# EAGLE design FSShield (EAGLE 9.5.2)
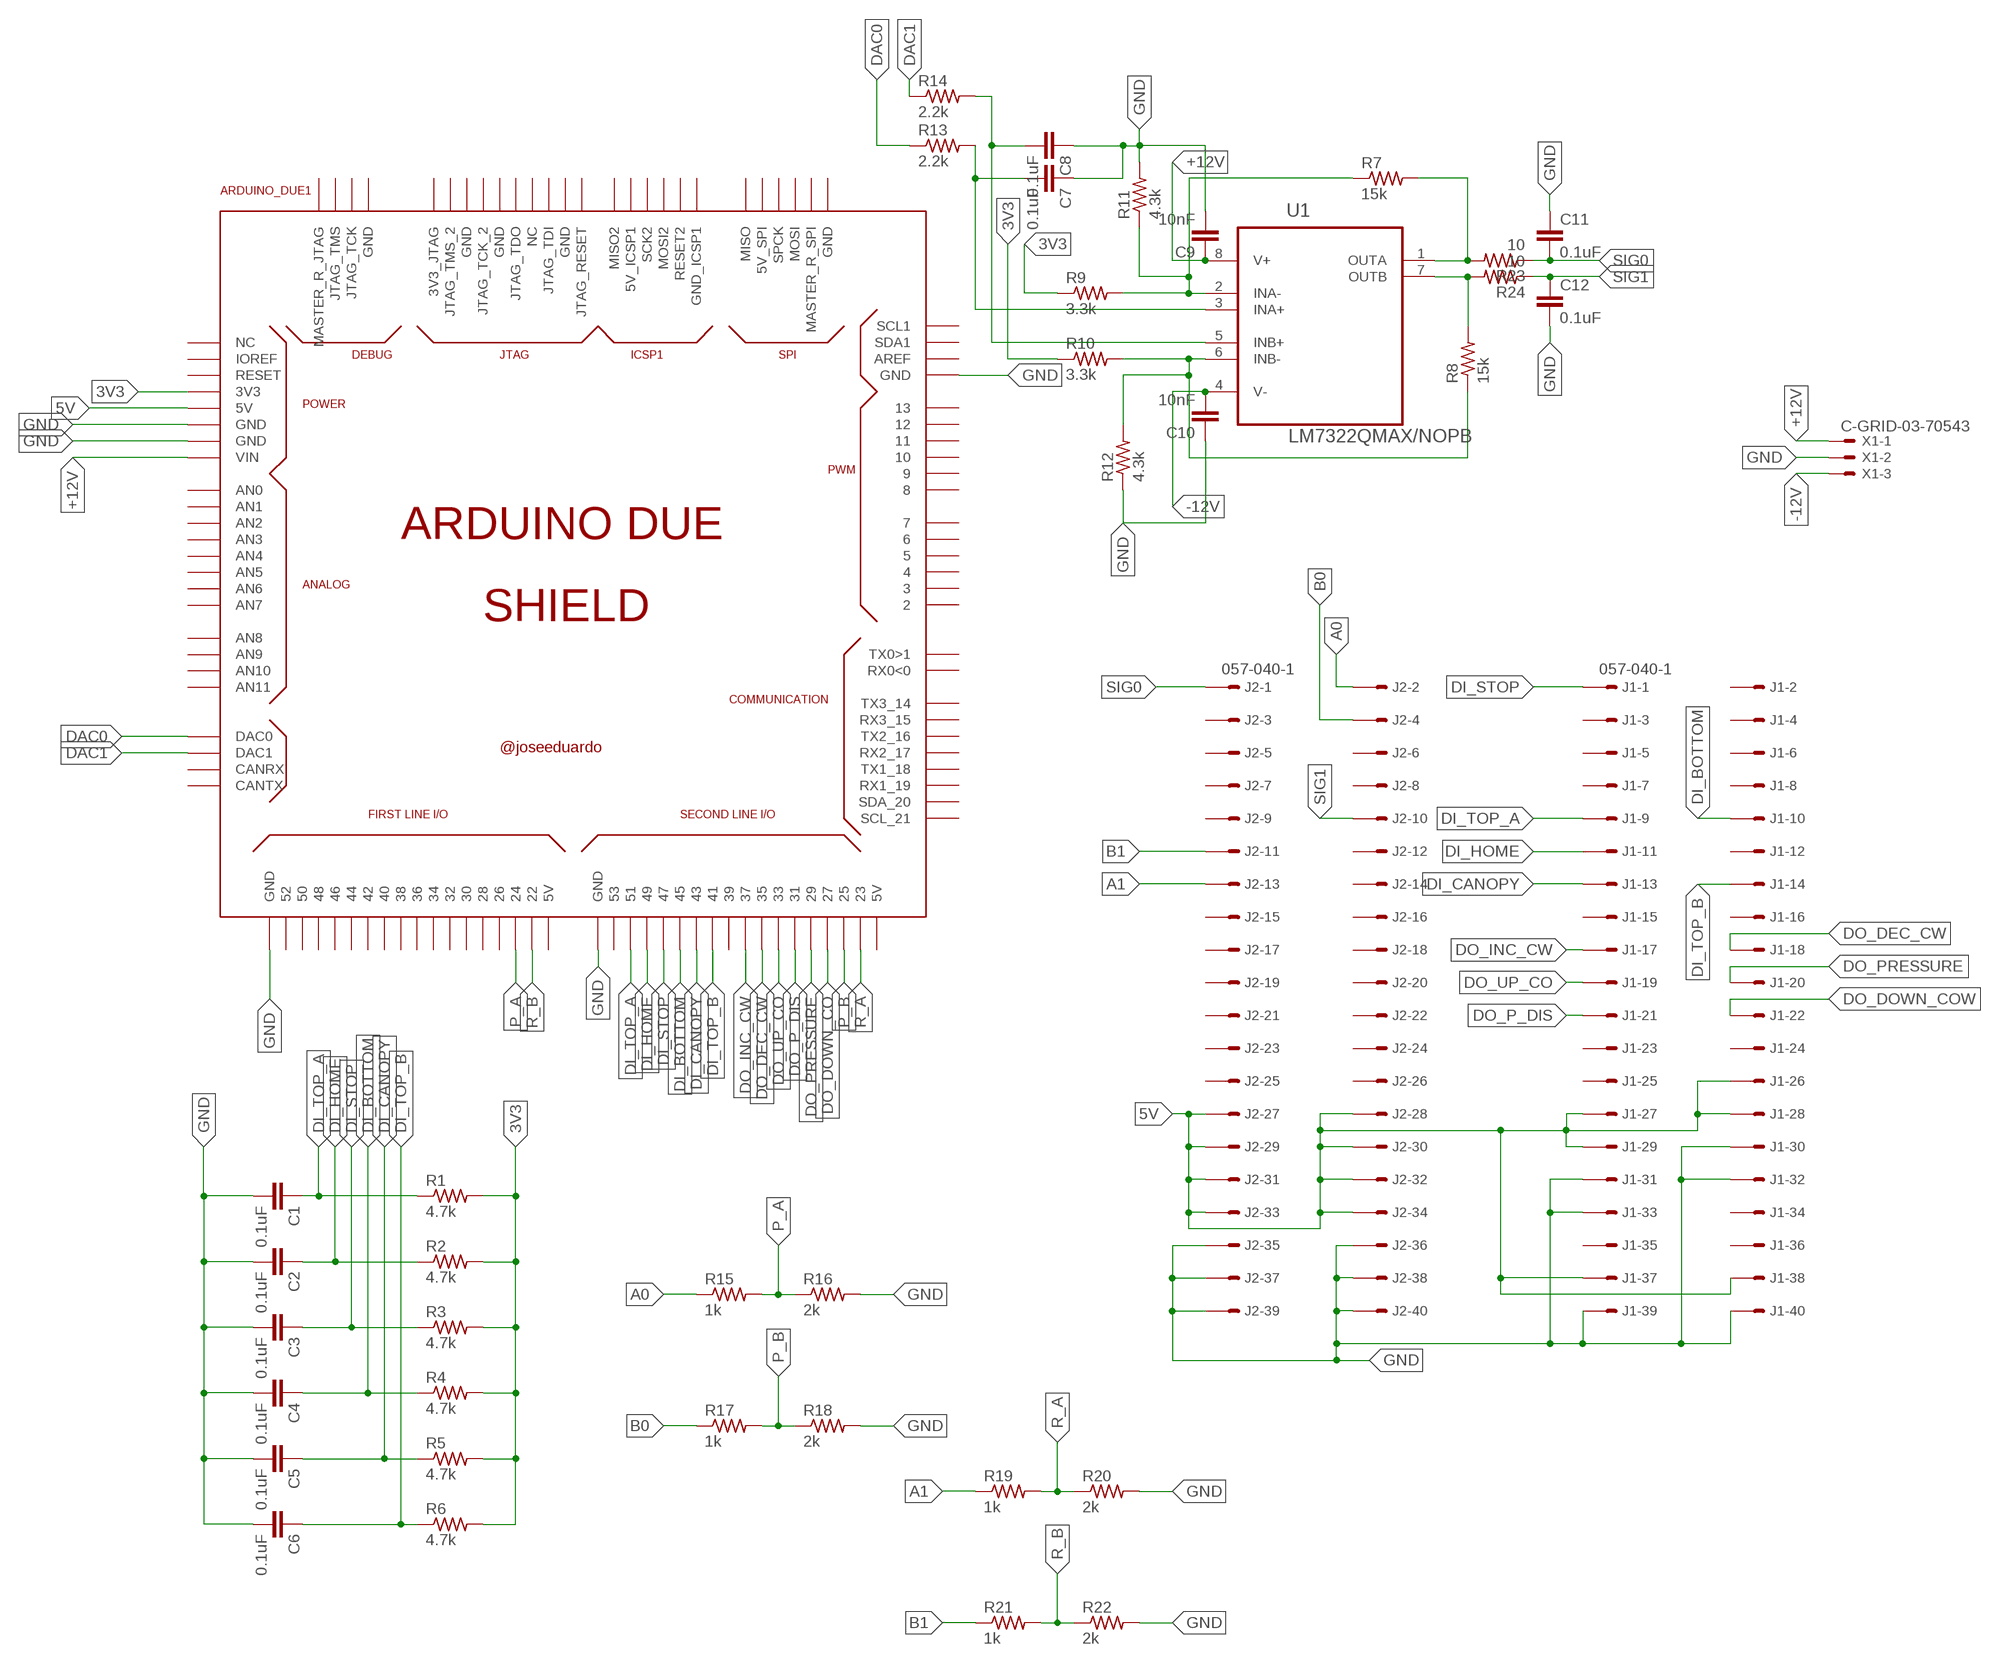
[diagram p0: schematic, sheet 1]

## Parts
ARDUINO_DUE1  ARDUINO_DUE_SHIELD  [ARDUINO_DUE_SHIELD]
C1  0.1uF  0.1UF-0603-25V-(+80/-20%)  [0603]
C2  0.1uF  0.1UF-0603-25V-(+80/-20%)  [0603]
C3  0.1uF  0.1UF-0603-25V-(+80/-20%)  [0603]
C4  0.1uF  0.1UF-0603-25V-(+80/-20%)  [0603]
C5  0.1uF  0.1UF-0603-25V-(+80/-20%)  [0603]
C6  0.1uF  0.1UF-0603-25V-(+80/-20%)  [0603]
C7  0.1uF  0.1UF-0603-25V-(+80/-20%)  [0603]
C8  0.1uF  0.1UF-0603-25V-(+80/-20%)  [0603]
C9  10nF  10NF-0603-50V-10%  [0603]
C10  10nF  10NF-0603-50V-10%  [0603]
C11  0.1uF  0.1UF-0603-25V-(+80/-20%)  [0603]
C12  0.1uF  0.1UF-0603-25V-(+80/-20%)  [0603]
J1  057-040-1  [057-040-1]
J2  057-040-1  [057-040-1]
R1  4.7k  R-US_M0805  [M0805]
R2  4.7k  R-US_M0805  [M0805]
R3  4.7k  R-US_M0805  [M0805]
R4  4.7k  R-US_M0805  [M0805]
R5  4.7k  R-US_M0805  [M0805]
R6  4.7k  R-US_M0805  [M0805]
R7  15k  R-US_M0805  [M0805]
R8  15k  R-US_M0805  [M0805]
R9  3.3k  R-US_M0805  [M0805]
R10  3.3k  R-US_M0805  [M0805]
R11  4.3k  R-US_M0805  [M0805]
R12  4.3k  R-US_M0805  [M0805]
R13  2.2k  R-US_M0805  [M0805]
R14  2.2k  R-US_M0805  [M0805]
R15  1k  R-US_M0805  [M0805]
R16  2k  R-US_M0805  [M0805]
R17  1k  R-US_M0805  [M0805]
R18  2k  R-US_M0805  [M0805]
R19  1k  R-US_M0805  [M0805]
R20  2k  R-US_M0805  [M0805]
R21  1k  R-US_M0805  [M0805]
R22  2k  R-US_M0805  [M0805]
R23  10  R-US_M0805  [M0805]
R24  10  R-US_M0805  [M0805]
U1  LM7322QMAX/NOPB  [SOIC127P600X175-8N]
X1  C-GRID-03-70543  [70543-03]

## Nets
3V3 [PWR]: ARDUINO_DUE1.3V3 R1.2 R2.2 R3.2 R4.2 R5.2 R6.2 R9.1 R10.1
5V [PWR]: ARDUINO_DUE1.5V0(5V) J1.26 J1.27 J1.28 J1.29 J1.37 J1.38 J2.27 J2.28 J2.29 J2.30 J2.31 J2.32 J2.33 J2.34
+12V [PWR]: ARDUINO_DUE1.VIN C9.1 U1.8(V+) X1.1
-12V [PWR]: C10.2 U1.4(V-) X1.3
A0: J2.2 R15.1
A1: J2.13 R19.1
B0: J2.4 R17.1
B1: J2.11 R21.1
DAC0: ARDUINO_DUE1.DAC0 R13.1
DAC1: ARDUINO_DUE1.DAC1 R14.1
DI_BOTTOM: ARDUINO_DUE1.45 C4.1 J1.10 R4.1
DI_CANOPY: ARDUINO_DUE1.43 C5.1 J1.13 R5.1
DI_HOME: ARDUINO_DUE1.49 C2.1 J1.11 R2.1
DI_STOP: ARDUINO_DUE1.47 C3.1 J1.1 R3.1
DI_TOP_A: ARDUINO_DUE1.51 C1.1 J1.9 R1.1
DI_TOP_B: ARDUINO_DUE1.41 C6.1 J1.14 R6.1
DO_DEC_CW: ARDUINO_DUE1.35 J1.18
DO_DOWN_CO: ARDUINO_DUE1.27
DO_DOWN_COW: J1.22
DO_INC_CW: ARDUINO_DUE1.37 J1.17
DO_P_DIS: ARDUINO_DUE1.31 J1.21
DO_PRESSURE: ARDUINO_DUE1.29 J1.20
DO_UP_CO: ARDUINO_DUE1.33 J1.19
GND [GND]: ARDUINO_DUE1.GND ARDUINO_DUE1.GND_1(GND) ARDUINO_DUE1.GND_2(GND) ARDUINO_DUE1.GND_3(GND) ARDUINO_DUE1.GND_4(GND) C1.2 C2.2 C3.2 C4.2 C5.2 C6.2 C7.1 C8.1 C9.2 C10.1 C11.1 C12.2 J1.30 J1.31 J1.32 J1.33 J1.39 J1.40 J2.35 J2.36 J2.37 J2.38 J2.39 J2.40 R11.2 R12.1 R16.2 R18.2 R20.2 R22.2 X1.2
N$1: R7.1 R9.2 R11.1 U1.2(INA-)
N$2: R8.1 R10.2 R12.2 U1.6(INB-)
N$3: C7.2 R13.2 U1.3(INA+)
N$4: C8.2 R14.2 U1.5(INB+)
N$5: C12.1 R24.1
N$6: C11.2 R23.1
P_A: ARDUINO_DUE1.24 R15.2 R16.1
P_B: ARDUINO_DUE1.25 R17.2 R18.1
R_A: ARDUINO_DUE1.23 R19.2 R20.1
R_B: ARDUINO_DUE1.22 R21.2 R22.1
SIG0: J2.1 R7.2 R23.2 U1.1(OUTA)
SIG1: J2.10 R8.2 R24.2 U1.7(OUTB)
Unconnected: ARDUINO_DUE1.0(RX0<0) ARDUINO_DUE1.1(TX0>1) ARDUINO_DUE1.2 ARDUINO_DUE1.3 ARDUINO_DUE1.3V3_JTAG ARDUINO_DUE1.4 ARDUINO_DUE1.5 ARDUINO_DUE1.5V0_1(5V) ARDUINO_DUE1.5V0_2(5V) ARDUINO_DUE1.5V_2(5V_SPI) ARDUINO_DUE1.5V_ICSP1 ARDUINO_DUE1.6 ARDUINO_DUE1.7 ARDUINO_DUE1.8 ARDUINO_DUE1.9 ARDUINO_DUE1.10 ARDUINO_DUE1.11 ARDUINO_DUE1.12 ARDUINO_DUE1.13 ARDUINO_DUE1.14(TX3_14) ARDUINO_DUE1.15(RX3_15) ARDUINO_DUE1.16(TX2_16) ARDUINO_DUE1.17(RX2_17) ARDUINO_DUE1.18(TX1_18) ARDUINO_DUE1.19(RX1_19) ARDUINO_DUE1.20(SDA_20) ARDUINO_DUE1.21(SCL_21) ARDUINO_DUE1.26 ARDUINO_DUE1.28 ARDUINO_DUE1.30 ARDUINO_DUE1.32 ARDUINO_DUE1.34 ARDUINO_DUE1.36 ARDUINO_DUE1.38 ARDUINO_DUE1.39 ARDUINO_DUE1.40 ARDUINO_DUE1.42 ARDUINO_DUE1.44 ARDUINO_DUE1.46 ARDUINO_DUE1.48 ARDUINO_DUE1.50 ARDUINO_DUE1.52 ARDUINO_DUE1.53 ARDUINO_DUE1.A0(AN0) ARDUINO_DUE1.A1(AN1) ARDUINO_DUE1.A2(AN2) ARDUINO_DUE1.A3(AN3) ARDUINO_DUE1.A4(AN4) ARDUINO_DUE1.A5(AN5) ARDUINO_DUE1.A6(AN6) ARDUINO_DUE1.A7(AN7) ARDUINO_DUE1.A8(AN8) ARDUINO_DUE1.A9(AN9) ARDUINO_DUE1.A10(AN10) ARDUINO_DUE1.A11(AN11) ARDUINO_DUE1.AREF ARDUINO_DUE1.CANRX ARDUINO_DUE1.CANTX ARDUINO_DUE1.GND_5(GND) ARDUINO_DUE1.GND_7(GND) ARDUINO_DUE1.GND_8(GND) ARDUINO_DUE1.GND_9(GND) ARDUINO_DUE1.GND_10(GND) ARDUINO_DUE1.GND_ICSP1 ARDUINO_DUE1.IOREF ARDUINO_DUE1.JTAG_RESET ARDUINO_DUE1.JTAG_TCK ARDUINO_DUE1.JTAG_TCK_2 ARDUINO_DUE1.JTAG_TDI ARDUINO_DUE1.JTAG_TDO ARDUINO_DUE1.JTAG_TMS ARDUINO_DUE1.JTAG_TMS_2 ARDUINO_DUE1.MASTER_RESET_JTAG(MASTER_R_JTAG) ARDUINO_DUE1.MASTER_RESET_SPI(MASTER_R_SPI) ARDUINO_DUE1.MISO ARDUINO_DUE1.MISO2 ARDUINO_DUE1.MOSI ARDUINO_DUE1.MOSI2 ARDUINO_DUE1.NC_2(NC) ARDUINO_DUE1.NC_5(NC) ARDUINO_DUE1.RESET ARDUINO_DUE1.RESET2 ARDUINO_DUE1.SCK2 ARDUINO_DUE1.SCL1 ARDUINO_DUE1.SDA1 ARDUINO_DUE1.SPCK J1.2 J1.3 J1.4 J1.5 J1.6 J1.7 J1.8 J1.12 J1.15 J1.16 J1.23 J1.24 J1.25 J1.34 J1.35 J1.36 J2.3 J2.5 J2.6 J2.7 J2.8 J2.9 J2.12 J2.14 J2.15 J2.16 J2.17 J2.18 J2.19 J2.20 J2.21 J2.22 J2.23 J2.24 J2.25 J2.26

## Library data of the parts
ARDUINO_DUE1 = arduino_due_shield (1):ARDUINO_DUE_SHIELD
C1-C8 C11 C12 = SparkFun-Capacitors:0.1UF: 0.1µF ceramic capacitors A capacitor is a passive two-terminal electrical component used to store electrical energy temporarily in an electric field.; PROD_ID: CAP-00810
C9 C10 = SparkFun-Capacitors:10NF: 0.01uF/10nF/10,000pF ceramic capacitors A capacitor is a passive two-terminal electrical component used to store electrical energy temporarily in an electric field. CAP-09321; PROD_ID: CAP-00867
J1 J2 = con-panduit:057-040-: CONNECTOR 40-pin series 057 contact pc board low profile headers; OC_FARNELL: unknown; OC_NEWARK: unknown
R1-R24 = resistor:R-US_: RESISTOR, American symbol
U1 = LM7322QMAX_NOPB:LM7322QMAX/NOPB: Operational Amplifier; AVAILABILITY: Unavailable; DESCRIPTION: Dual Ch, ail-to- ail I/O, High Output Current & Unlimited Cap Load +/-15V Op Amp 8-SOIC -40 to 125; MF: Texas Instruments; MP: LM7322QMAX/NOPB; PACKAGE: SOIC-8 Texas Instruments; PRICE: None
X1 = con-molex:C-GRID-03: CONNECTOR wire to board 2.54 mm (0.100") pitch header; MF: MOLEX; OC_FARNELL: unknown; OC_NEWARK: unknown

## Net classes
1 GND: width 0.61 mm
2 PWR: width 0.61 mm

## Board
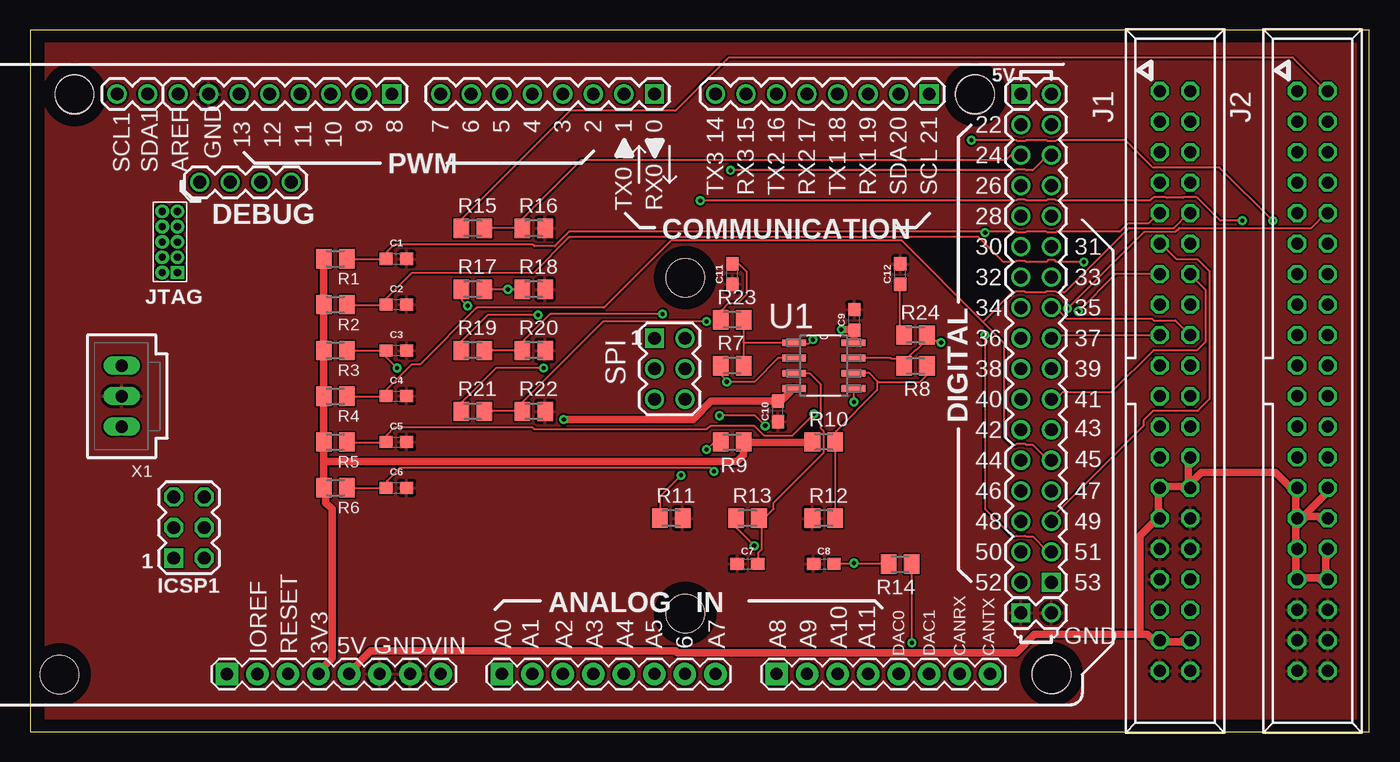
[diagram p1: board, top side]
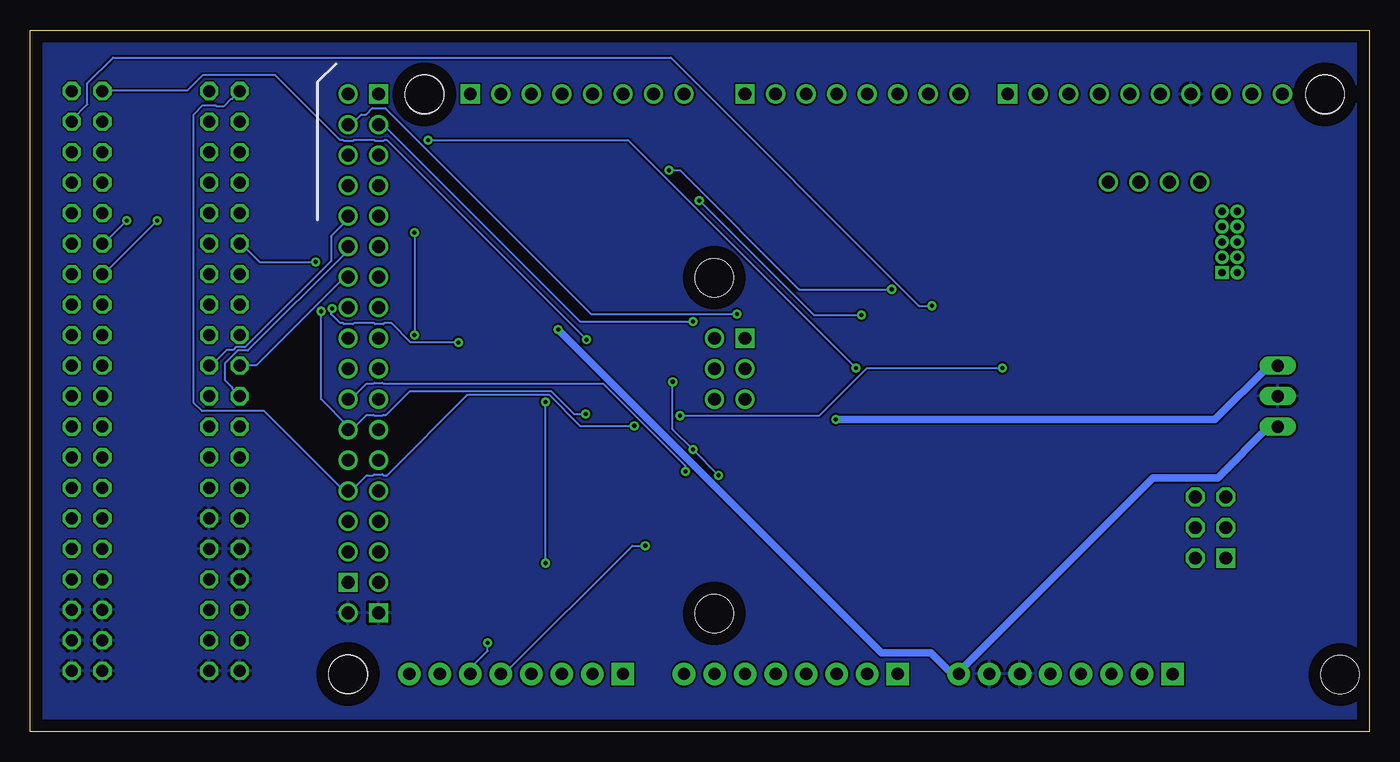
[diagram p2: board, bottom side, seen from below]

Size 111.43 x 58.41 mm. Coordinates in mm from the lower left corner, seen from the top.
Outline: 0,0 111.43,0 111.43,58.41 0,58.41 0,0
Copper layers (1*16): Top 0.035mm / dielectric 1.5mm / Bottom 0.035mm
Design rules "default": minimum track width 6mil, minimum drill 0.35mm, track to track 6mil, track to pad 6mil, pad to pad 6mil, via to via 6mil, smd to smd 6mil, copper to edge 40mil, drill to drill 6mil, minimum pad ring 10mil, minimum via ring 8mil, stop-mask expansion 4mil, vias tented up to drill 0mil, thermal gap 10mil

### Footprints (pad centres in the part's own frame; a part is rotated, then mirrored left to right if it is on the bottom)
ARDUINO_DUE_SHIELD = drill 1.067 square: 0 63.373,51.816; 5V0_1 93.853,51.816; 8 41.529,51.816; 21 86.233,51.816; 53 96.393,11.176; GND_2 93.853,8.636; MISO 63.373,31.496; MISO2 23.384,13.196 | drill 1.067: 1 60.833,51.816; 2 58.293,51.816; 3 55.753,51.816; 4 53.213,51.816; 5 50.673,51.816; 5V0_2 96.393,51.816; 5V_2 65.913,31.496; 6 48.133,51.816; 7 45.593,51.816; 9 38.989,51.816; 10 36.449,51.816; 11 33.909,51.816; 12 31.369,51.816; 13 28.829,51.816; 14 68.453,51.816; 15 70.993,51.816; 16 73.533,51.816; 17 76.073,51.816; 18 78.613,51.816; 19 81.153,51.816; 20 83.693,51.816; 22 93.853,49.276; 23 96.393,49.276; 24 93.853,46.736; 25 96.393,46.736; 26 93.853,44.196; 27 96.393,44.196; 28 93.853,41.656; 29 96.393,41.656; 30 93.853,39.116; 31 96.393,39.116; 32 93.853,36.576; 33 96.393,36.576; 34 93.853,34.036; 35 96.393,34.036; 36 93.853,31.496; 37 96.393,31.496; 38 93.853,28.956; 39 96.393,28.956; 40 93.853,26.416; 41 96.393,26.416; 42 93.853,23.876; 43 96.393,23.876; 44 93.853,21.336; 45 96.393,21.336; 46 93.853,18.796; 47 96.393,18.796; 48 93.853,16.256; 49 96.393,16.256; 50 93.853,13.716; 51 96.393,13.716; 52 93.853,11.176; AREF 23.749,51.816; GND_3 96.393,8.636; GND_4 26.289,51.816; GND_5 65.913,26.416; GND_7 33.161,44.473; JTAG_TCK 30.621,44.473; JTAG_TMS 28.081,44.473; MASTER_RESET_JTAG 25.541,44.473; MASTER_RESET_SPI 63.373,26.416; MOSI 65.913,28.956; SCL1 18.669,51.816; SDA1 21.209,51.816; SPCK 63.373,28.956 | drill 1.016 pad 1.88: 3V3 35.433,3.556; 5V0 37.973,3.556; A1 53.213,3.556; A2 55.753,3.556; A3 58.293,3.556; A4 60.833,3.556; A5 63.373,3.556; A6 65.913,3.556; A7 68.453,3.556; A9 76.073,3.556; A10 78.613,3.556; A11 81.153,3.556; CANRX 88.773,3.556; CANTX 91.313,3.556; DAC0 83.693,3.556; DAC1 86.233,3.556; GND 40.513,3.556; GND_1 43.053,3.556; IOREF 30.346,3.543; RESET 32.893,3.555; VIN 45.593,3.556 | drill 0.6 pad 1.016 square: 3V3_JTAG 23.689,36.964 | drill 1.067 octagon: 5V_ICSP1 25.924,13.196; GND_ICSP1 25.924,18.276; MOSI2 25.924,15.736; RESET2 23.384,18.276; SCK2 23.384,15.736 | drill 1.016 pad 1.88 square: A0 50.673,3.556; A8 73.533,3.556; NC_2 27.806,3.543 | drill 0.6 pad 1.143: GND_8 23.689,38.234; GND_9 23.689,40.774; GND_10 23.689,42.044; JTAG_RESET 22.419,42.044; JTAG_TCK_2 22.419,38.234; JTAG_TDI 22.419,40.774; JTAG_TDO 22.419,39.504; JTAG_TMS_2 22.419,36.964; NC_5 23.689,39.504 | hole 3.2: 15.113,51.816; 90.043,51.816; 96.393,3.556; 96.418,3.505; 15.138,51.765; 90.068,51.765; 13.868,3.505; 65.938,36.525; 65.938,8.585
0603 = smd 1.1 x 1: 1 -0.85,0; 2 0.85,0
057-040-1 = drill 1 octagon: 1 -24.13,-1.27; 2 -24.13,1.27; 3 -21.59,-1.27; 4 -21.59,1.27; 5 -19.05,-1.27; 6 -19.05,1.27; 7 -16.51,-1.27; 8 -16.51,1.27; 9 -13.97,-1.27; 10 -13.97,1.27; 11 -11.43,-1.27; 12 -11.43,1.27; 13 -8.89,-1.27; 14 -8.89,1.27; 15 -6.35,-1.27; 16 -6.35,1.27; 17 -3.81,-1.27; 18 -3.81,1.27; 19 -1.27,-1.27; 20 -1.27,1.27; 21 1.27,-1.27; 22 1.27,1.27; 23 3.81,-1.27; 24 3.81,1.27; 25 6.35,-1.27; 26 6.35,1.27; 27 8.89,-1.27; 28 8.89,1.27; 29 11.43,-1.27; 30 11.43,1.27; 31 13.97,-1.27; 32 13.97,1.27; 33 16.51,-1.27; 34 16.51,1.27; 35 19.05,-1.27; 36 19.05,1.27; 37 21.59,-1.27; 38 21.59,1.27; 39 24.13,-1.27; 40 24.13,1.27
M0805 = smd 1.3 x 1.6: 1 -0.95,0; 2 0.95,0
SOIC127P600X175-8N = smd 1.981 x 0.559: 1 -2.464,1.905; 2 -2.464,0.635; 3 -2.464,-0.635; 4 -2.464,-1.905; 5 2.464,-1.905; 6 2.464,-0.635; 7 2.464,0.635; 8 2.464,1.905
70543-03 = drill 1.016 long: 1 -2.54,0; 2 0,0; 3 2.54,0

### Placement (x,y rotation side)
ARDUINO_DUE1  -11.43,1.27 0 top
C1  30.48,39.37 0 top
C2  30.48,35.56 0 top
C3  30.48,31.75 0 top
C4  30.48,27.94 0 top
C5  30.48,24.13 0 top
C6  30.48,20.32 0 top
C7  59.69,13.97 0 top
C8  66.04,13.97 0 top
C9  68.58,34.29 90 top
C10  62.23,26.67 90 top
C11  58.42,38.1 90 top
C12  72.39,38.1 90 top
J1  95.25,29.21 270 top
J2  106.68,29.21 270 top
R1  25.4,39.37 180 top
R2  25.4,35.56 180 top
R3  25.4,31.75 180 top
R4  25.4,27.94 180 top
R5  25.4,24.13 180 top
R6  25.4,20.32 180 top
R7  58.42,30.48 0 top
R8  73.66,30.48 180 top
R9  58.42,24.13 180 top
R10  66.04,24.13 0 top
R11  53.34,17.78 0 top
R12  66.04,17.78 0 top
R13  59.69,17.78 0 top
R14  72.39,13.97 180 top
R15  36.83,41.91 0 top
R16  41.91,41.91 0 top
R17  36.83,36.83 0 top
R18  41.91,36.83 0 top
R19  36.83,31.75 0 top
R20  41.91,31.75 0 top
R21  36.83,26.67 0 top
R22  41.91,26.67 0 top
R23  58.42,34.29 0 top
R24  73.66,33.02 0 top
U1  66.04,30.48 0 top
X1  7.62,27.94 90 top

### Tracks (layer width: path | path; a pad name or v marks a point on that pad's centre or on a via)
3V3
  Top 0.61: R10.1 65.05,24.11 59.41,24.11 R9.1 59.33,23.8 59.33,23.04 58.8,22.5 24.44,22.5 | 24.44,22.5 24.44,24.11 R5.2 24.44,24.41 24.44,27.91 R4.2 24.44,28.22 24.44,31.72 R3.2 24.44,32.03 24.44,35.53 R2.2 24.44,35.84 24.44,39.34 R1.2 | 24.44,22.5 24.44,20.37 R6.2 24.59,20.07 24.59,19.07 25.12,18.54 25.12,6.12 24.05,5.05 24.05,4.83 ARDUINO_DUE1.3V3
5V
  Top 0.61: J1.28 96.52,20.3 95.91,20.3 95.76,20.45 94.61,20.45 94.46,20.3 94.23,20.3 J1.27 94,20.3 94,19.84 93.85,19.68 93.85,18.54 94,18.39 94,17.78 J1.29 93.7,17.7 92.33,16.33 92.33,8.1 | J1.26 96.52,22.28 96.37,22.12 96.37,21.06 96.6,20.83 96.6,20.6 J1.28 | J2.32 107.95,14.66 107.8,14.5 107.8,13.44 108.03,13.21 108.03,12.98 J2.34 107.95,12.68 107.34,12.68 107.19,12.83 106.05,12.83 105.89,12.68 105.66,12.68 J2.33 105.36,12.75 105.36,13.36 105.28,13.44 105.28,14.58 105.44,14.73 105.44,15.19 J2.31 105.44,15.49 105.44,15.72 105.28,15.88 105.28,17.02 105.44,17.17 105.44,17.78 J2.29 | J2.30 107.34,17.78 107.19,17.93 106.2,17.93 | 106.2,17.93 105.89,17.63 105.66,17.63 J2.29 | J2.29 105.59,18.01 105.59,18.24 105.28,18.54 105.28,19.61 105.36,19.68 105.36,20.3 J2.27 105.05,20.3 104.9,20.3 103.61,21.59 97.43,21.59 96.83,20.98 J1.28 | J2.28 107.95,19.99 106.12,18.16 106.2,17.93 | J1.38 96.52,7.64 95.91,7.64 95.76,7.49 94.69,7.49 94.61,7.57 94,7.57 J1.37 93.7,7.57 93.47,7.57 92.94,8.1 92.33,8.1 | 92.33,8.1 83.57,8.1 82.04,6.58 53.85,6.58 53.7,6.73 28.32,6.73 26.57,4.98 26.57,4.83 ARDUINO_DUE1.5V0
+12V  (via drill 0.35)
  Top 0.61: U1.8 68.56,32.41 68.56,33.4 C9.1 68.25,33.48 v67.49,33.48
  Bottom 0.61: v67.49,33.48 40.59,6.58 36.47,6.58 34.72,4.83 ARDUINO_DUE1.VIN 34.11,5.05 18.03,21.13 12.62,21.13 8.36,25.4 X1.1
-12V  (via drill 0.35)
  Top 0.61: U1.4 63.53,28.6 62.46,27.53 62.23,27.53 C10.2 62,27.53 56.67,27.53 55.14,26.01 v44.4,26.01
  Bottom 0.61: v44.4,26.01 12.85,26.01 8.43,30.43 7.67,30.43 X1.3
A0
  Top 0.152: R15.1 35.94,41.93 35.94,42.7 44.93,51.69 53.7,51.69 58.11,56.11 105.05,56.11 107.8,53.36 107.95,53.36 J2.2
A1  (via drill 0.35)
  Top 0.152: v42.27,34.7 38.08,34.7 35.94,32.56 35.94,31.8 R19.1 | v55.75,44.22 82.04,44.22 82.12,44.3 82.8,44.3 82.88,44.22 84.56,44.22 84.63,44.3 85.32,44.3 85.39,44.22 93.17,44.22 93.47,44.53 94.46,44.53 94.54,44.45 95.91,44.45 95.99,44.53 97.05,44.53 99.03,42.54 v100.86,42.54
  Bottom 0.152: v42.27,34.7 46.23,34.7 v55.75,44.22 | v100.86,42.54 105.36,38.05 J2.13
B0  (via drill 0.35)
  Top 0.152: v36.4,35.46 35.94,35.92 35.94,36.83 R17.1
  Bottom 0.152: v36.4,35.46 37.47,35.46 58.11,56.11 104.52,56.11 106.66,53.97 106.66,52.22 107.95,50.93 J2.4
B1  (via drill 0.35)
  Top 0.152: v42.72,30.28 38.76,30.28 35.94,27.46 35.94,26.7 R21.1 | v78.31,49.25 82.04,49.25 82.12,49.17 82.8,49.17 82.88,49.25 84.56,49.25 84.63,49.17 85.32,49.17 85.39,49.25 91.11,49.25 93.4,46.96 98.96,46.96 v103.38,42.54
  Bottom 0.152: v42.72,30.28 61.7,49.25 v78.31,49.25 | v103.38,42.54 105.28,40.64 J2.11
DAC0  (via drill 0.35)
  Top 0.152: v60.25,15.49 58.8,16.94 58.8,17.78 R13.1
  Bottom 0.152: v60.25,15.49 61.32,15.49 71.98,4.83 ARDUINO_DUE1.DAC0
DAC1  (via drill 0.35)
  Top 0.152: v73.36,7.42 73.36,13.97 R14.1
  Bottom 0.152: v73.36,7.42 73.36,6.73 74.8,5.28 ARDUINO_DUE1.DAC1
DI_BOTTOM
  Top 0.152: R4.1 26.42,27.91 29.62,27.91 C4.1 29.69,27.99 29.69,28.52 31.75,30.58 32.44,30.58 37.16,35.31 47.75,35.31 53.31,40.87 72.52,40.87 79.26,34.12 | 79.26,34.12 81.05,32.33 81.05,24.56 81.74,23.88 81.97,23.88 82.04,23.95 82.8,23.95 82.88,23.88 83.41,23.88 84.63,22.66 84.94,22.66 ARDUINO_DUE1.45 | 79.26,34.12 81.74,36.6 81.97,36.6 82.04,36.68 82.73,36.68 82.8,36.6 84.48,36.6 84.56,36.68 85.32,36.68 85.39,36.6 86.08,36.6 91.42,41.93 95.15,41.93 96.37,43.15 96.52,43.15 J1.10
DI_CANOPY  (via drill 0.35)
  Top 0.152: R5.1 26.42,24.11 29.62,24.11 C5.1 29.69,24.18 29.69,24.71 30.3,25.32 41.81,25.32 41.96,25.17 56.29,25.17 56.59,25.48 60.25,25.48 61.09,24.64 63.37,24.64 v65.2,26.47 | v87.22,35 90.35,38.12 93.93,38.12 J1.13
  Bottom 0.152: v65.2,26.47 66.19,26.47 68.1,28.37 79.83,28.37 81.81,26.39 82.04,26.39 82.12,26.31 82.8,26.31 82.88,26.39 83.41,26.39 84.63,25.17 84.94,25.17 ARDUINO_DUE1.43 85.01,25.17 85.01,25.48 87.22,27.69 v87.22,35
DI_HOME  (via drill 0.35)
  Top 0.152: R2.1 26.42,35.53 29.62,35.53 C2.1 29.69,35.61 29.69,36.14 31.75,38.2 41.88,38.2 44.86,41.17 78.92,41.17 80.97,39.12 81.97,39.12 82.04,39.19 82.8,39.19 82.88,39.12 84.56,39.12 84.71,39.27 85.24,39.27 85.39,39.12 v87.68,39.12 | J1.11 94.08,40.64 95.38,39.34 97.13,39.34 98.12,38.35 98.12,27.69 97.13,26.7 93.4,26.7 92.63,25.93 92.63,25.48 85.01,17.86 85.01,17.55 ARDUINO_DUE1.49
  Bottom 0.152: v87.68,39.12 92.33,39.12 93.85,40.64 J1.11
DI_STOP  (via drill 0.35)
  Top 0.152: R3.1 26.42,31.72 29.62,31.72 C3.1 29.62,31.65 29.62,31.19 v30.53,30.28 | v57.35,26.31 60.33,26.31 v61.16,25.48
  Bottom 0.152: v30.53,30.28 41.81,30.28 45.77,26.31 v57.35,26.31 | v61.16,25.48 65.66,25.48 68.25,28.07 75.03,28.07 81.74,21.36 82.04,21.36 82.12,21.44 82.8,21.44 82.88,21.36 83.41,21.36 84.71,20.07 ARDUINO_DUE1.47 85.32,20.07 91.95,26.7 97.13,26.7 97.81,27.38 97.81,51.38 97.05,52.15 95.99,52.15 95.91,52.07 95.3,52.07 94.69,52.68 94.61,52.68 94,53.29 J1.1
DI_TOP_A  (via drill 0.35)
  Top 0.152: R1.1 26.42,39.34 29.62,39.34 C1.1 29.69,39.42 29.69,39.95 30.3,40.56 41.81,40.56 41.96,40.41 43.64,40.41 44.86,41.63 79.45,41.63 | 79.45,41.63 82.04,41.63 82.12,41.55 82.8,41.55 82.88,41.63 84.56,41.63 84.63,41.55 85.32,41.55 85.39,41.63 90.65,41.63 91.34,42.32 93.02,42.32 93.93,43.23 J1.9 | v79.45,33.02 79.45,18.54 81.74,16.26 81.97,16.26 82.04,16.33 82.8,16.33 82.88,16.26 83.41,16.26 84.63,15.04 84.94,15.04 ARDUINO_DUE1.51 | 79.45,41.63 v79.45,41.55
  Bottom 0.152: v79.45,41.55 v79.45,33.02
DI_TOP_B  (via drill 0.35)
  Top 0.152: R6.1 26.42,20.3 29.62,20.3 C6.1 29.69,20.37 29.69,20.9 30.76,21.97 56.59,21.97 v56.9,21.67 | ARDUINO_DUE1.41 85.32,27.69 85.93,28.3 89.97,28.3 93.47,31.8 97.13,31.8 97.81,32.49 97.81,36.75 96.52,38.05 J1.14
  Bottom 0.152: v56.9,21.67 56.9,22.12 63.75,28.98 82.04,28.98 82.12,29.06 82.8,29.06 82.88,28.98 83.41,28.98 84.71,27.69 ARDUINO_DUE1.41
DO_DEC_CW
  Top 0.152: J1.18 95.3,34.24 93.47,34.24 93.32,34.39 86.23,34.39 85.32,35.31 ARDUINO_DUE1.35
DO_INC_CW
  Top 0.152: J1.17 85.85,33.02 85.62,32.79 85.01,32.79 ARDUINO_DUE1.37
DO_P_DIS
  Bottom 0.152: J1.21 94,27.99 94.61,28.6 94.61,28.68 95.22,29.29 95.22,30.66 94.16,31.72 93.32,31.72 85.01,40.03 85.01,40.33 ARDUINO_DUE1.31
DO_PRESSURE
  Bottom 0.152: J1.20 96.52,30.5 96.37,30.5 95.07,31.8 94.54,31.8 94.31,32.03 93.55,32.03 86.39,39.19 86.39,41.25 85.01,42.62 85.01,42.93 ARDUINO_DUE1.29
DO_UP_CO
  Bottom 0.152: J1.19 93.93,30.5 92.63,30.5 85.32,37.82 85.01,37.82 ARDUINO_DUE1.33
GND
  pour Top: 1.27,58.42 1.27,0 111.76,0 111.76,58.42
  pour Bottom: 0,58.42 111.76,58.42 111.76,1.27 110.49,0 0,0 0,57.15
N$1  (via drill 0.35)
  Top 0.152: 58,29.17 58.04,29.13 60.25,29.13 62.23,31.11 U1.2 | 58,29.17 57.51,29.67 57.51,30.43 R7.1 | v54.15,21.36 52.4,19.61 R11.1 | v56.29,23.5 56.9,24.11 57.43,24.11 R9.2 | v57.96,29.13 58,29.17
  Bottom 0.152: v54.15,21.36 v56.29,23.5 57.96,25.17 v57.96,29.13
N$2
  Top 0.152: R12.2 66.95,17.78 66.95,24.11 R10.2 67.03,24.18 67.03,25.02 70.46,28.45 70.46,29.13 70.5,29.17 | 70.5,29.17 69.77,29.9 68.56,29.9 U1.6 | 70.5,29.17 70.54,29.13 74.04,29.13 74.57,29.67 74.57,30.43 R8.1
N$3
  Top 0.152: 60.86,17.55 60.86,17.63 60.71,17.78 R13.2 60.86,17.55 | 60.86,17.55 60.86,15.19 60.55,14.88 60.55,13.97 C7.2 | 60.86,17.55 61.85,18.54 61.85,19.07 66.04,23.27 66.04,25.02 65.81,25.25 65.81,28.91 64.9,29.82 63.6,29.82 U1.3
N$4  (via drill 0.35)
  Top 0.152: R14.2 68.56,13.97 | 68.56,13.97 C8.2 | v68.56,27.46 68.56,28.52 U1.5 | 68.56,13.97 v68.56,14.05
  Bottom 0.152: v68.56,14.05 v68.56,27.46
N$5
  Top 0.152: C12.1 72.36,37.21 72.36,33.32 72.67,33.02 R24.1
N$6
  Top 0.152: C11.2 58.42,38.89 59.03,38.89 59.64,38.28 59.64,36.45 58.88,35.69 58.11,35.69 57.51,35.08 57.51,34.31 R23.1
P_A
  Top 0.152: R15.2 37.85,41.93 40.89,41.93 R16.1 40.89,42.01 40.89,42.62 45.85,47.57 81.2,47.57 81.66,48.03 82.42,48.03 ARDUINO_DUE1.24
P_B  (via drill 0.35)
  Top 0.152: R18.1 v39.75,36.83 R17.2 | v58.27,46.74 81.97,46.74 82.04,46.81 82.8,46.81 82.88,46.74 83.41,46.74 84.63,47.95 84.94,47.95 ARDUINO_DUE1.25
  Bottom 0.152: v39.75,36.83 47.45,36.83 57.35,46.74 v58.27,46.74
R_A  (via drill 0.35)
  Top 0.152: R19.2 37.85,31.72 40.89,31.72 R20.1 40.97,31.8 40.97,32.49 43.26,34.77 v52.63,34.77
  Bottom 0.152: v52.63,34.77 64.75,34.77 81.89,51.92 82.96,51.92 83.49,51.38 83.87,51.38 84.71,50.55 ARDUINO_DUE1.23
R_B  (via drill 0.35)
  Top 0.152: R21.2 37.85,26.7 40.89,26.7 R22.1 40.89,26.77 40.89,27.38 47.68,34.16 v56.29,34.16
  Bottom 0.152: v56.29,34.16 65.66,34.16 82.04,50.55 ARDUINO_DUE1.22
SIG0  (via drill 0.35)
  Top 0.152: 59.33,32.41 59.33,34.24 R23.2 | 59.33,32.41 59.33,30.5 R7.2 | 59.33,32.41 63.53,32.41 U1.1 63.6,32.33 64.82,32.33 v65.13,32.64
  Bottom 0.152: v65.13,32.64 81.74,49.25 81.97,49.25 82.04,49.17 82.73,49.17 82.8,49.25 84.48,49.25 84.56,49.17 85.32,49.17 85.39,49.25 85.62,49.25 91.03,54.66 97.05,54.66 98.35,53.36 105.36,53.36 J2.1
SIG1  (via drill 0.35)
  Top 0.152: U1.7 71.6,31.11 71.68,31.04 72.82,31.04 R8.2 72.75,30.5 72.75,30.89 73.66,31.8 73.74,31.8 74.57,32.64 74.57,33.02 R24.2 74.57,32.56 75.49,32.56 75.64,32.41 v75.79,32.41 | v86.31,35.23 92.71,41.63 95.3,41.63 95.61,41.93 106.58,41.93 107.8,43.15 107.95,43.15 J2.10
  Bottom 0.152: v86.31,35.23 86.31,35.15 86.39,35.08 86.39,34.77 85.62,34.01 85.39,34.01 85.32,33.93 84.56,33.93 84.48,34.01 82.8,34.01 82.73,33.93 82.04,33.93 81.97,34.01 81.36,34.01 79.76,32.41 v75.79,32.41